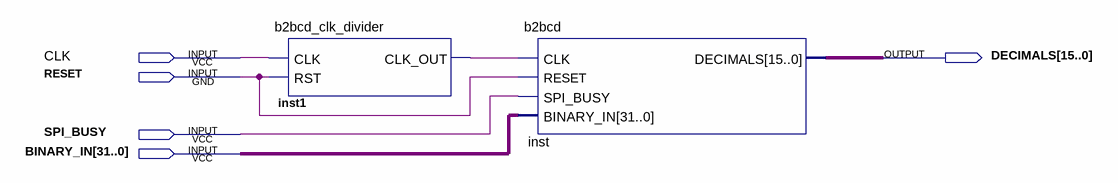
[diagram p0: schematic sheet]
// Quartus schematic b2bcd_full.bdf as structural Verilog: 2 symbols, 5 pins
module b2bcd_full (
  input  CLK,
  input  RESET,
  input  SPI_BUSY,
  input  [31:0] BINARY_IN,
  output [15:0] DECIMALS
);

  wire inst1_clk_out;

  b2bcd_clk_divider inst1 (.CLK(CLK), .RST(RESET), .CLK_OUT(inst1_clk_out));
  b2bcd inst (.CLK(inst1_clk_out), .RESET(RESET), .SPI_BUSY(SPI_BUSY), .BINARY_IN(BINARY_IN), .DECIMALS(DECIMALS));
endmodule
